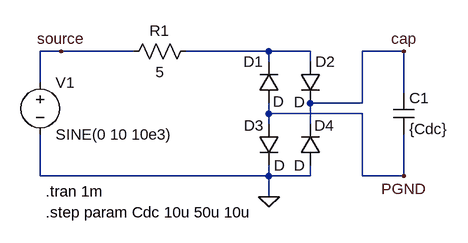
[diagram p0: schematic rectifier.asc]
rectifier.asc, the LTspice schematic file:
Version 4
SHEET 1 880 680
WIRE 80 80 48 80
WIRE 192 80 80 80
WIRE 400 80 272 80
WIRE 464 80 400 80
WIRE 608 80 544 80
WIRE 400 96 400 80
WIRE 464 96 464 80
WIRE 48 128 48 80
WIRE 608 144 608 80
WIRE 544 160 544 80
WIRE 544 160 464 160
WIRE 400 176 400 160
WIRE 544 176 400 176
WIRE 400 192 400 176
WIRE 464 192 464 160
WIRE 48 272 48 208
WIRE 400 272 400 256
WIRE 400 272 48 272
WIRE 464 272 464 256
WIRE 464 272 400 272
WIRE 544 272 544 176
WIRE 608 272 608 208
WIRE 608 272 544 272
WIRE 400 304 400 272
FLAG 80 80 source
FLAG 400 304 0
FLAG 608 272 PGND
FLAG 608 80 cap
SYMBOL voltage 48 112 R0
WINDOW 123 0 0 Left 0
WINDOW 39 0 0 Left 0
SYMATTR InstName V1
SYMATTR Value SINE(0 10 10e3)
SYMBOL res 288 64 R90
WINDOW 0 0 56 VBottom 2
WINDOW 3 32 56 VTop 2
SYMATTR InstName R1
SYMATTR Value 5
SYMBOL diode 416 160 R180
WINDOW 0 24 64 Left 2
WINDOW 3 -8 3 Left 2
SYMATTR InstName D1
SYMBOL diode 448 96 R0
WINDOW 3 -9 62 Left 2
SYMATTR InstName D2
SYMBOL diode 384 192 R0
WINDOW 0 -22 2 Left 2
SYMATTR InstName D3
SYMBOL diode 480 256 R180
WINDOW 0 -21 62 Left 2
WINDOW 3 24 0 Left 2
SYMATTR InstName D4
SYMBOL cap 592 144 R0
SYMATTR InstName C1
SYMATTR Value {Cdc}
TEXT 56 296 Left 2 !.tran 1m
TEXT 56 328 Left 2 !.step param Cdc 10u 50u 10u

The netlist it stands for:
* rectifier.asc
V1 source 0 SINE(0 10 10e3)
R1 N001 source 5
D1 PGND N001 D
D2 N001 cap D
D3 PGND 0 D
D4 0 cap D
C1 cap PGND {Cdc}
.model D D
.lib standard.dio
.tran 1m
.step param Cdc 10u 50u 10u
.backanno
.end